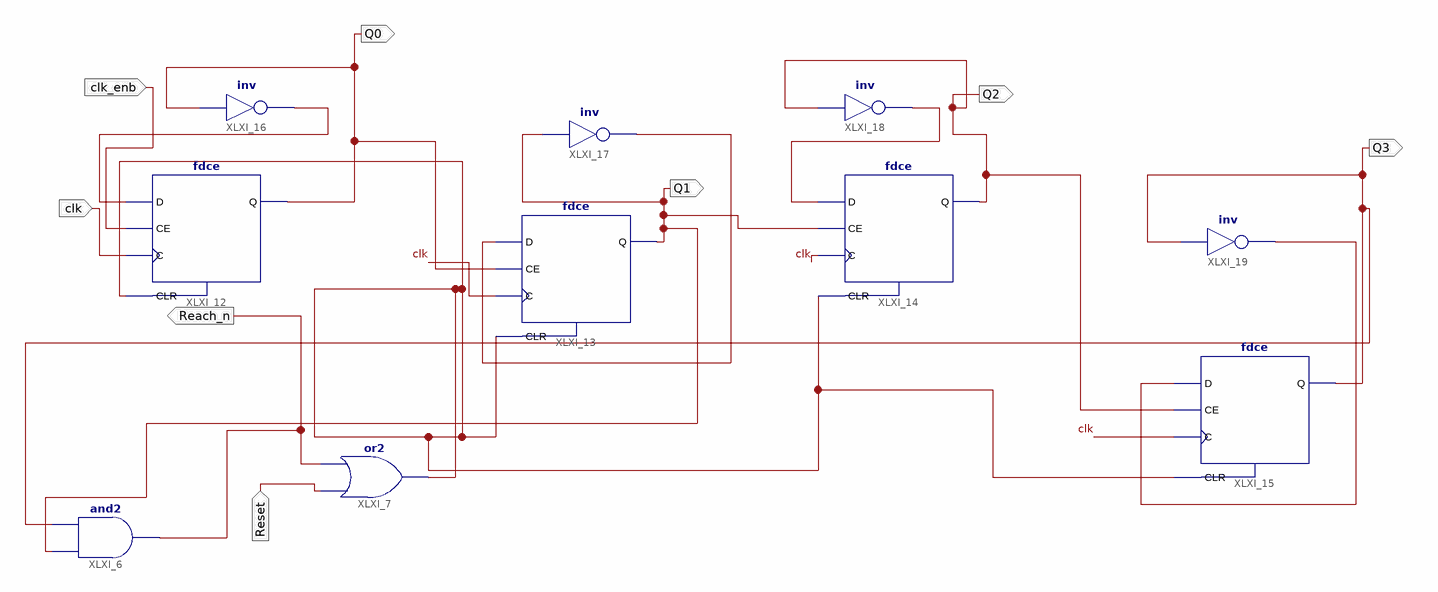
[diagram p0: schematic sheet 1]
// Xilinx ISE schematic Mod_10_Counter.sch (spartan3e) as structural Verilog: 10 symbols, 8 ports
module Mod_10_Counter (
  input  clk,
  input  Reset,
  input  clk_enb,
  output Reach_n,
  output Q0,
  output Q1,
  output Q2,
  output Q3
);

  wire XLXN_34, XLXN_79, XLXN_80, XLXN_83, XLXN_85;

  and XLXI_6 (Reach_n, Q1, Q3);
  or XLXI_7 (XLXN_34, Reset, Reach_n);
  fdce XLXI_12 (.C(clk), .CE(clk_enb), .CLR(XLXN_34), .D(XLXN_79), .Q(Q0));
  fdce XLXI_13 (.C(clk), .CE(Q0), .CLR(XLXN_34), .D(XLXN_80), .Q(Q1));
  fdce XLXI_14 (.C(clk), .CE(Q1), .CLR(XLXN_34), .D(XLXN_83), .Q(Q2));
  fdce XLXI_15 (.C(clk), .CE(Q2), .CLR(XLXN_34), .D(XLXN_85), .Q(Q3));
  not XLXI_16 (XLXN_79, Q0);
  not XLXI_17 (XLXN_80, Q1);
  not XLXI_18 (XLXN_83, Q2);
  not XLXI_19 (XLXN_85, Q3);
endmodule
